# EAGLE design breakout (EAGLE 6.5.0)
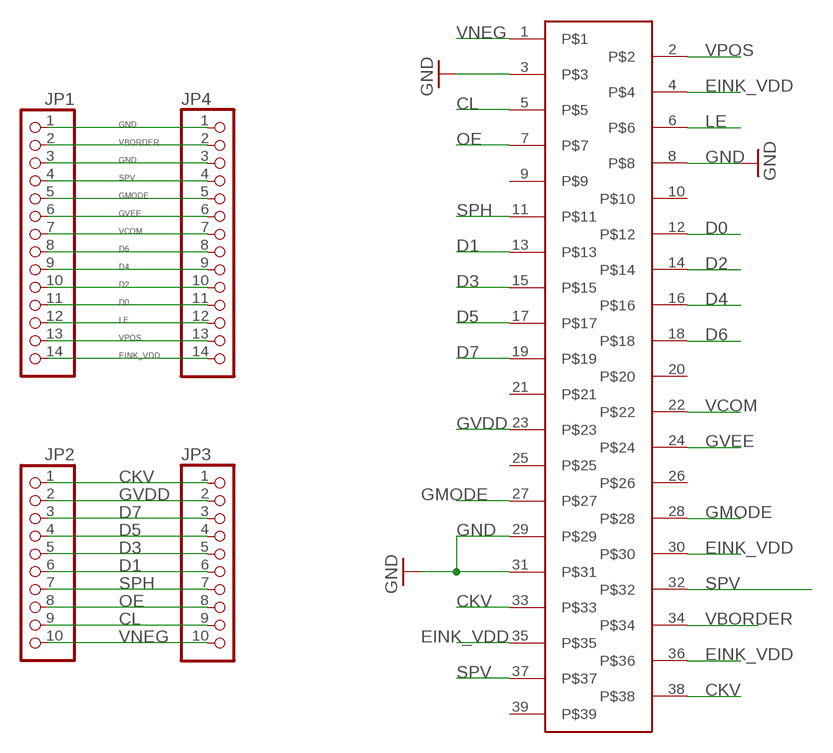
[diagram p0: schematic, sheet 1]

## Parts
JP1  PINHD-1X14  [1X14]
JP2  PINHD-1X10  [1X10]
JP3  PINHD-1X10  [1X10]
JP4  PINHD-1X14  [1X14]
U$1  JCT-39  [JCT-39]

## Nets
CKV: JP2.1 JP3.1 U$1.33 U$1.38
CL: JP2.9 JP3.9 U$1.5
D0: JP1.11 JP4.11 U$1.12
D1: JP2.6 JP3.6 U$1.13
D2: JP1.10 JP4.10 U$1.14
D3: JP2.5 JP3.5 U$1.15
D4: JP1.9 JP4.9 U$1.16
D5: JP2.4 JP3.4 U$1.17
D6: JP1.8 JP4.8 U$1.18
D7: JP2.3 JP3.3 U$1.19
EINK_VDD: JP1.14 JP4.14 U$1.4 U$1.30 U$1.35 U$1.36
GMODE: JP1.5 JP4.5 U$1.27 U$1.28
GND: JP1.1 JP1.3 JP4.1 JP4.3 U$1.3 U$1.8 U$1.29 U$1.31
GVDD: JP2.2 JP3.2 U$1.23
GVEE: JP1.6 JP4.6 U$1.24
LE: JP1.12 JP4.12 U$1.6
OE: JP2.8 JP3.8 U$1.7
SPH: JP2.7 JP3.7 U$1.11
SPV: JP1.4 JP4.4 U$1.32 U$1.37
VBORDER: JP1.2 JP4.2 U$1.34
VCOM: JP1.7 JP4.7 U$1.22
VNEG: JP2.10 JP3.10 U$1.1
VPOS: JP1.13 JP4.13 U$1.2
Unconnected: U$1.9 U$1.10 U$1.20 U$1.21 U$1.25 U$1.26 U$1.39

## Library data of the parts
JP1 JP4 = pinhead:PINHD-1X14: PIN HEADER
JP2 JP3 = pinhead:PINHD-1X10: PIN HEADER
U$1 = jct:JCT-39

## Board
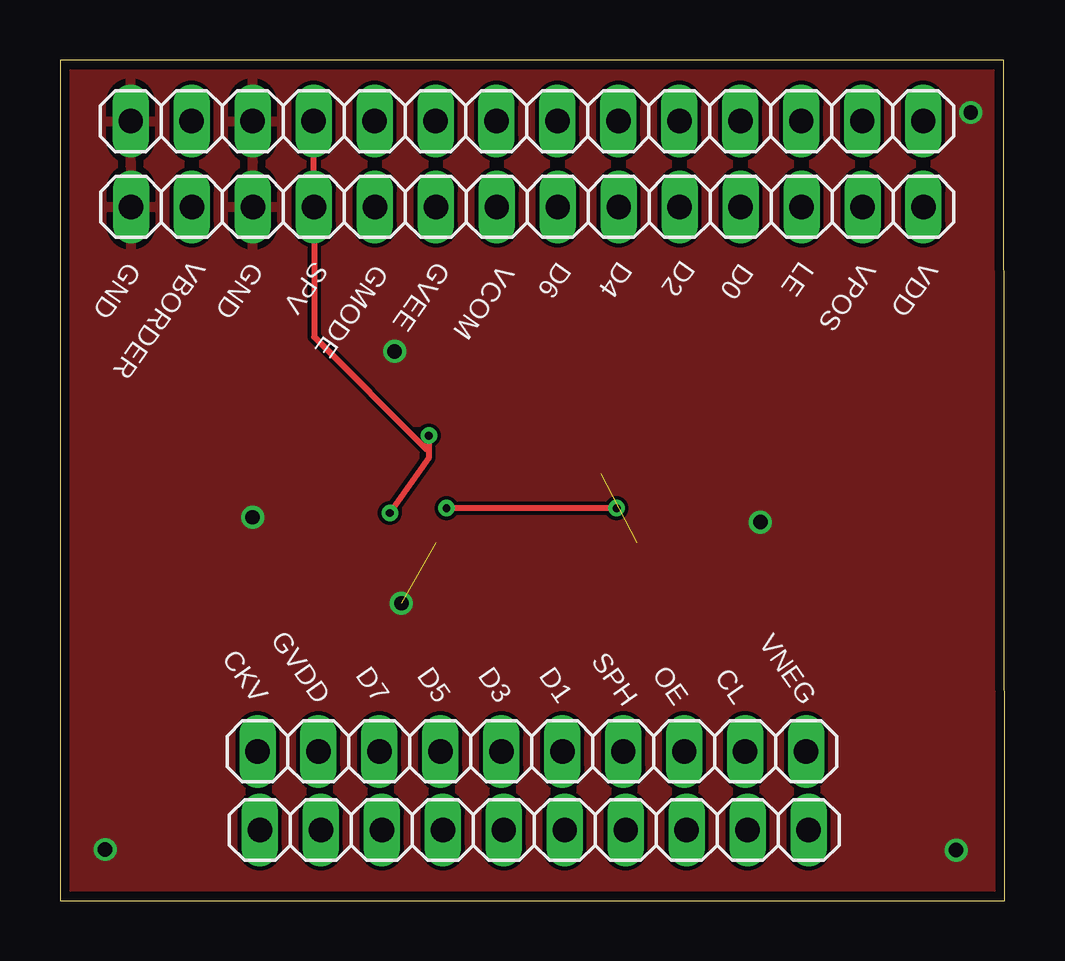
[diagram p1: board, top side]
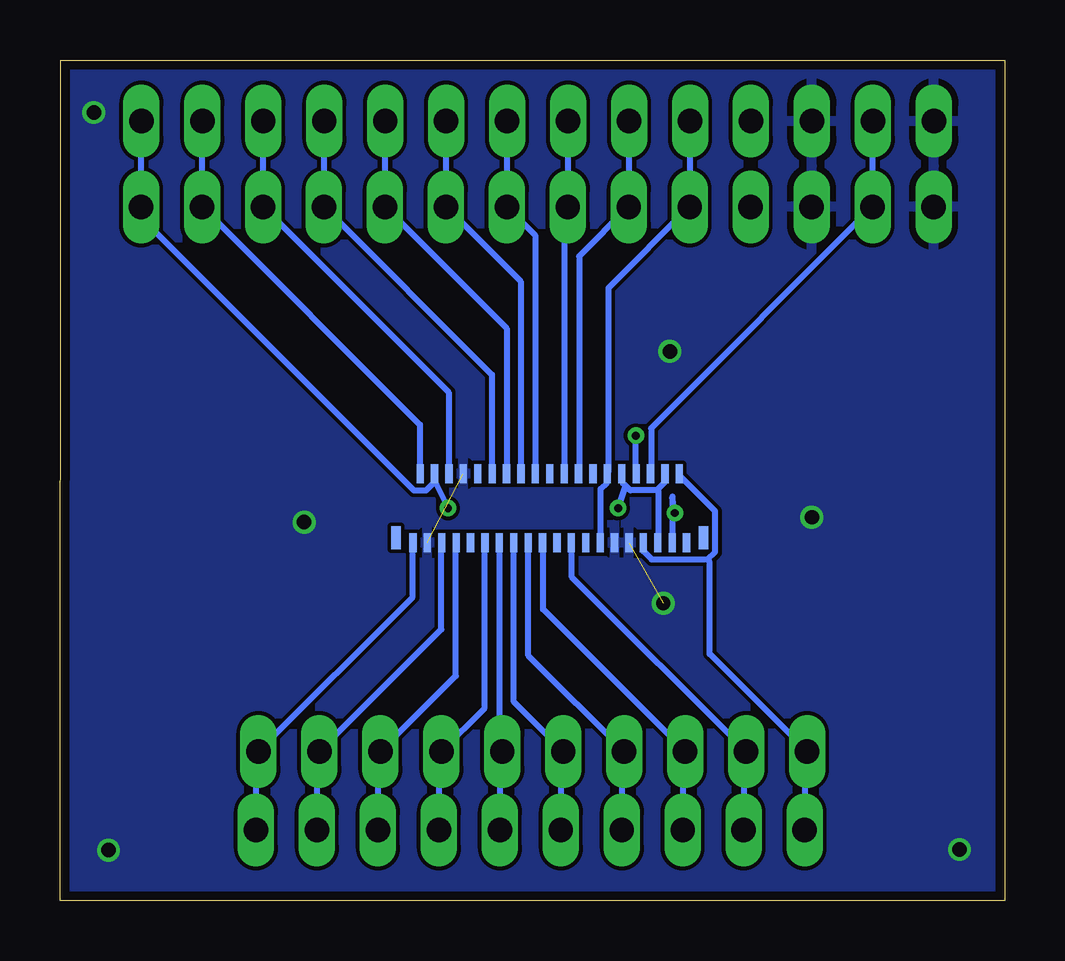
[diagram p2: board, bottom side, seen from below]

Size 39.36 x 35.03 mm. Coordinates in mm from the lower left corner, seen from the top.
Outline: 0,0 39.36,0 39.33,35.03 0,35.03 0,0
Copper layers (1*16): Top 0.0356mm / dielectric 1.5011mm / Bottom 0.0356mm
Design rules "oshpark *": minimum track width 10mil, minimum drill 13mil, track to track 6mil, track to pad 6mil, pad to pad 6mil, via to via 6mil, smd to smd 6mil, copper to edge 15mil, drill to drill 6mil, minimum pad ring 7mil, minimum via ring 7mil, stop-mask expansion 3mil, vias tented up to drill 0mil, thermal gap 10mil

### Footprints (pad centres in the part's own frame; a part is rotated, then mirrored left to right if it is on the bottom)
1X14 = drill 1.016 long: 1 -16.51,0; 2 -13.97,0; 3 -11.43,0; 4 -8.89,0; 5 -6.35,0; 6 -3.81,0; 7 -1.27,0; 8 1.27,0; 9 3.81,0; 10 6.35,0; 11 8.89,0; 12 11.43,0; 13 13.97,0; 14 16.51,0
1X10 = drill 1.016 long: 1 -11.43,0; 2 -8.89,0; 3 -6.35,0; 4 -3.81,0; 5 -1.27,0; 6 1.27,0; 7 3.81,0; 8 6.35,0; 9 8.89,0; 10 11.43,0
JCT-39 = smd 0.3 x 0.8: 1 0,-1.438; 2 0.3,1.438; 3 0.6,-1.438; 4 0.9,1.438; 5 1.2,-1.438; 6 1.5,1.438; 7 1.8,-1.438; 8 2.1,1.438; 9 2.4,-1.438; 10 2.7,1.438; 11 3,-1.438; 12 3.3,1.438; 13 3.6,-1.438; 14 3.9,1.438; 15 4.2,-1.438; 16 4.5,1.438; 17 4.8,-1.438; 18 5.1,1.438; 19 5.4,-1.438; 20 5.7,1.438; 21 6,-1.438; 22 6.3,1.438; 23 6.6,-1.438; 24 6.9,1.438; 25 7.2,-1.438; 26 7.5,1.438; 27 7.8,-1.438; 28 8.1,1.438; 29 8.4,-1.438; 30 8.7,1.438; 31 9,-1.438; 32 9.3,1.438; 33 9.6,-1.438; 34 9.9,1.438; 35 10.2,-1.438; 36 10.5,1.438; 37 10.8,-1.438; 38 11.1,1.438; 39 11.4,-1.438 | smd 0.4 x 0.95: MNT1 -0.7,-1.238; MNT2 12.1,-1.238

### Placement (x,y rotation side)
JP1  19.46,32.49 0 top
JP2  19.76,2.95 0 top
JP3  19.66,6.22 0 top
JP4  19.47,28.91 0 top
U$1  24.65,16.36 0 bottom

### Tracks (layer width: path | path; a pad name or v marks a point on that pad's centre or on a via)
CKV
  Bottom 0.254: 12.37,14.22 12.06,14.53 12.06,16.23 13.54,17.7 13.54,17.78 U$1.38 | 12.37,14.22 14.71,14.22 15.04,14.55 15.04,14.91 U$1.33 | 12.37,14.22 12.29,14.12 12.29,10.29 JP3.1 8.33,6.15 JP2.1
CL
  Bottom 0.254: U$1.5 23.47,14.91 23.47,11.3 JP3.9 28.65,6.15 JP2.9
D0
  Bottom 0.254: U$1.12 21.36,17.8 21.36,21.92 28.35,28.91 JP4.11 28.35,29.01 JP1.11
D1
  Bottom 0.254: U$1.13 21.03,14.91 21.03,6.33 JP3.6 21.03,6.15 JP2.6
D2
  Bottom 0.254: U$1.14 20.75,23.85 25.81,28.91 JP4.10 25.81,29.01 JP1.10
D3
  Bottom 0.254: U$1.15 20.45,8.28 JP3.5 18.49,6.15 JP2.5
D4
  Bottom 0.254: U$1.16 20.17,17.8 20.17,25.81 23.27,28.91 JP4.9 23.27,29.01 JP1.9
D5
  Bottom 0.254: U$1.17 19.84,14.91 19.84,10.21 JP3.4 15.95,6.15 JP2.4
D6
  Bottom 0.254: U$1.18 19.56,27.74 20.73,28.91 JP4.8 20.73,29.01 JP1.8
D7
  Bottom 0.254: U$1.19 19.23,14.91 19.23,12.14 JP3.3 13.41,6.15 JP2.3
EINK_VDD  (via drill 0.33)
  Top 0.254: v23.19,16.36 v16.1,16.36
  Bottom 0.254: 14.43,17.09 14.43,17.17 14.17,17.42 14.17,17.78 U$1.36 | 14.43,17.09 14.43,14.94 U$1.35 | 15.79,17.29 15.6,17.09 14.43,17.09 | 15.79,17.29 15.93,17.42 15.93,17.78 U$1.30 | 23.77,17.42 23.77,17.78 U$1.4 | 23.77,17.42 24.11,17.09 24.61,17.09 35.97,28.45 35.97,28.91 JP4.14 35.97,29.01 JP1.14 | v16.1,16.36 15.79,17.29 | v23.19,16.36 23.67,17.35 23.77,17.42
GMODE
  Bottom 0.254: U$1.27 16.84,14.94 16.84,17.14 16.56,17.42 16.56,17.78 U$1.28 16.51,17.91 16.51,25.53 13.13,28.91 JP4.5 13.11,29.01 JP1.5
GND  (via drill 0.6)  (2 unrouted)
  other vias: 8.03,15.98 13.94,22.89 14.22,12.4 29.18,15.77 37.95,32.84 1.88,2.13 37.34,2.11
  pour Top: 40.64,-1.27 40.82,36.46 -1.05,36.56 -0.95,-1.27
  pour Bottom: -1.21,36.21 -0.95,-1.27 40.32,-1.27 40.45,36.21
GVDD
  Bottom 0.254: U$1.23 18.03,14.91 18.03,13.49 JP3.2 10.87,6.15 JP2.2
GVEE
  Bottom 0.254: U$1.24 17.73,17.8 17.73,26.85 15.67,28.91 JP4.6 15.65,29.01 JP1.6
LE
  Bottom 0.254: U$1.6 23.16,17.8 23.16,21.18 30.89,28.91 JP4.12 30.89,29.01 JP1.12
OE
  Bottom 0.254: U$1.7 22.86,9.37 JP3.8 26.11,6.15 JP2.8
SPH
  Bottom 0.254: U$1.11 21.67,14.91 21.67,8.03 JP3.7 23.57,6.15 JP2.7
SPV  (via drill 0.33)
  Top 0.254: v13.74,16.15 15.37,18.47 v15.37,19.38 15.29,18.8 10.59,23.5 10.59,28.91 JP4.4 10.57,29.01 JP1.4
  Bottom 0.254: v13.74,16.15 13.84,16.84 13.84,14.94 U$1.37 | v15.37,19.38 15.37,17.8 U$1.32
VBORDER
  Bottom 0.254: U$1.34 14.73,17.8 14.73,19.68 5.51,28.91 JP4.2 5.49,29.01 JP1.2
VCOM
  Bottom 0.254: U$1.22 18.34,17.8 18.34,28.78 18.21,28.91 JP4.7 18.19,29.01 JP1.7
VNEG
  Bottom 0.254: U$1.1 24.66,14.91 24.66,12.65 JP3.10 31.19,6.15 JP2.10
VPOS
  Bottom 0.254: U$1.2 24.36,19.84 33.43,28.91 JP4.13 33.43,29.01 JP1.13

### Text on the board
tPlace: GND | VBORDER | GND | SPV | GMODE | GVEE | VCOM | D6 | D4 | D2 | D0 | LE | VPOS | VDD | CKV | GVDD | D7 | D5 | D3 | D1 | SPH | OE | CL | VNEG